# Altium schematic sheet 02 Mobile Power.SchDoc: Mezzanine Power
size B; Author: JSK; Revision: A; SheetNumber: 2; SheetTotal: 2; AssemblyNumber: ECE453 Power; CurrentDate: 1/09/2018
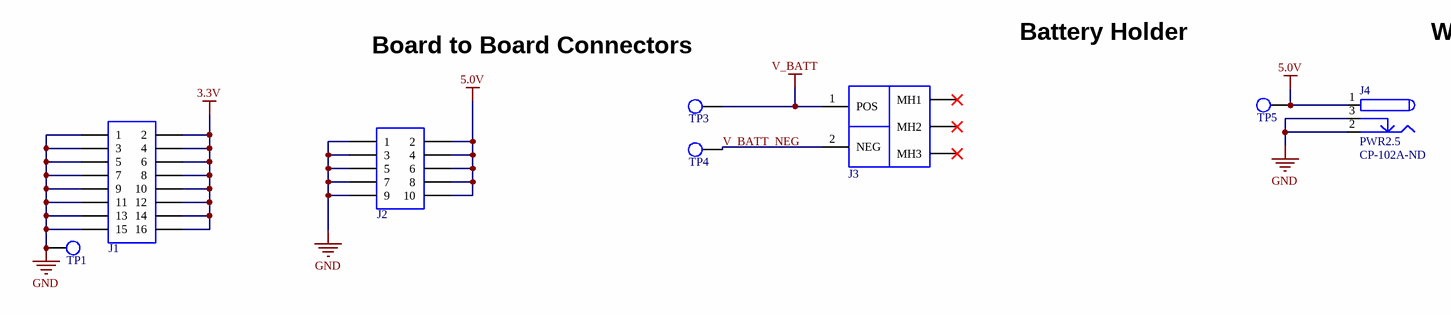
[diagram p0: 02 Mobile Power.SchDoc]

## Parts
J1  CONN_HEADER_MALE_8x2  [SBH11-PBPC-D08-ST-BK]  (value not drawn)
J2  CONN_HEADER_MALE_5x2  [SBH11-PBPC-D05-ST-BK]  (value not drawn)
J3  CONN_BAT_18650  [1043]  (value not drawn)
J4  PWR2.5  Supplier Part Number 1: CP-102A-ND  [PJ-102]
TP1  TP_1206  [TP-SMC-1206]  (value not drawn)
TP3  TP_1206  [TP-SMC-1206]  (value not drawn)
TP4  TP_1206  [TP-SMC-1206]  (value not drawn)
TP5  TP_1206  [TP-SMC-1206]  (value not drawn)

## Nets
3.3V: J1.2 J1.4 J1.6 J1.8 J1.10 J1.12 J1.14 J1.16
5.0V: J2.2 J2.4 J2.6 J2.8 J2.10 J4.1 TP5.1
GND: J1.1 J1.3 J1.5 J1.7 J1.9 J1.11 J1.13 J1.15 J2.1 J2.3 J2.5 J2.7 J2.9 J4.2 J4.3 TP1.1
V_BATT: J3.1(POS) TP3.1
V_BATT_NEG: J3.2(NEG) TP4.1

Not connected (* = marked no-connect by the designer): J3 MH1* MH2* MH3*

## Notes on the sheet
- Board to Board Connectors
- (near J3) Battery Holder
- Wall Wort Connector
- Title:
- Size:
- B
- Machine:
- P.C. Board No:
- Assembly No:
- Rev:
- Sheet:
- of
- College of Engineering
- 1415 Engineering Drive
- Madison, WI 53706

## Library data of the parts
J1 = CONN_HEADER_MALE_8x2: CONN HEADER 2.54MM 16POS GOLD; Manufacturer: Sullins Connector Solutions; Pitch: 0.100" (2.54mm); Number of Positions Loaded: All; Number of Positions: 16; Connector Type: Header, Shrouded; Contact Finish Thickness: Flash; Contact Mating Length: -; Fastening Type: -; Contact Finish: Gold; Packaging: Tray; Row Spacing: 0.100" (2.54mm); RoHS: RoHS Compliant; Contact Type: Male Pin; Category: Connectors, Interconnects; Part Status: Active; Features: Polarizing Key; Color: Black; Mounting Type: Through Hole; Termination: Solder; Manufacturer Part Number: SBH11-PBPC-D08-ST-BK; Number of Rows: 2; Supplier 1: Digi-Key; Stock 1: 13784; Pricing 1: 1=0.55, 10=0.428, 25=0.3988, 50=0.3626, 100=0.3263, 250=0.27552, 500=0.261, 1000=0.232, 2500=0.19285 (USD); ComponentLink1URL: http://sullinscorp.com/catalogs/145_PAGE118_.100_SBH11_SERIES_MALE_BOX_HDR_ST_RA_SMT.pdf; ComponentLink1Description: http://sullinscorp.com/catalogs/145_PAGE118_.100_SBH11_SERIES_MALE_BOX_HDR_ST_RA_SMT.pdf; Supplier Part Number 1: S9171-ND
J2 = CONN_HEADER_MALE_5x2: CONN HEADER 2.54MM 10POS GOLD; Manufacturer: Sullins Connector Solutions; Pitch: 0.100" (2.54mm); Number of Positions: 10; Number of Positions Loaded: All; Connector Type: Header, Shrouded; Contact Mating Length: -; Fastening Type: -; Termination: Solder; Mounting Type: Through Hole; Color: Black; Contact Finish Thickness: Flash; Row Spacing: 0.100" (2.54mm); Contact Finish: Gold; Number of Rows: 2; Features: Polarizing Key; Contact Type: Male Pin; Manufacturer Part Number: SBH11-PBPC-D05-ST-BK; Category: Connectors, Interconnects; Packaging: Tray; Part Status: Active; RoHS: RoHS Compliant; Supplier 1: Digi-Key; Stock 1: 29227; Pricing 1: 1=0.64, 10=0.445, 25=0.3812, 50=0.343, 100=0.2985, 250=0.254, 500=0.2413, 1000=0.2159, 2500=0.17145 (USD); ComponentLink1URL: http://sullinscorp.com/catalogs/145_PAGE118_.100_SBH11_SERIES_MALE_BOX_HDR_ST_RA_SMT.pdf; ComponentLink1Description: http://sullinscorp.com/catalogs/145_PAGE118_.100_SBH11_SERIES_MALE_BOX_HDR_ST_RA_SMT.pdf; Supplier Part Number 1: S9169-ND
J3 = CONN_BAT_18650: HOLDER FOR 18650 BATTERY
J4 = PWR2.5: Low Voltage Power Supply Connector; Manufacturer: CUI; Manufacturer Part Number: PJ-102A; Gender: Male; Shielding: Unshielded; Current Rating: 2.5A; Connector Type: Jack; Voltage Rating: 24V; Insulation Resistance: 50MR; Number of Conductors: 2; Published: 17-Dec-2003; DatasheetDocument: 09-May-2002; Publisher: Altium Limited; ComponentLink1Description: Manufacturer Link; ComponentLink1URL: http://domino.kycon.com/internet/Products.html; Supplier 1: Digi-Key; Stock 1: 20997; Pricing 1: 1=0.64, 10=0.6, 25=0.54, 50=0.48, 100=0.46, 250=0.42, 500=0.4, 1000=0.33, 2500=0.3 (USD); Mount: Through Hole; Colour: Black; Contact Material: Copper; Contact Plating: Nickel; Housing Colour: Black; Housing Material: Thermoplastic; Min Operating Temperature: -25°C; Max Operating Temperature: 85°C; Package Quantity: 280; Termination: Through Hole; Contact Gender: Male; Orientation: Horizontal; Packaging: Bulk; Diameter: 2.1mm; Lead Free: Lead Free; Flammability Rating: UL94 V-0; ComponentLink2URL: http://www.cui.com/Product/Resource/FuturePDF/PJ-102A.pdf; ComponentLink2Description: http://www.cui.com/Product/Resource/FuturePDF/PJ-102A.pdf; ComponentLink3URL: http://www.mouser.com/ds/2/670/PJ-102A-524195.pdf; ComponentLink3Description: http://www.mouser.com/ds/2/670/PJ-102A-524195.pdf; ComponentLink4URL: https://www.cui.com/product/resource/digikeypdf/pj-102a.pdf; ComponentLink4Description: https://www.cui.com/product/resource/digikeypdf/pj-102a.pdf
TP1 TP3-TP5 = TP_1206: Test Point SMD 1206; Supplier 1: Digi-Key; Supplier Part Number 1: A106143CT-ND